# Altium project SAT_GPS_CLOCK_1.PrjPcb
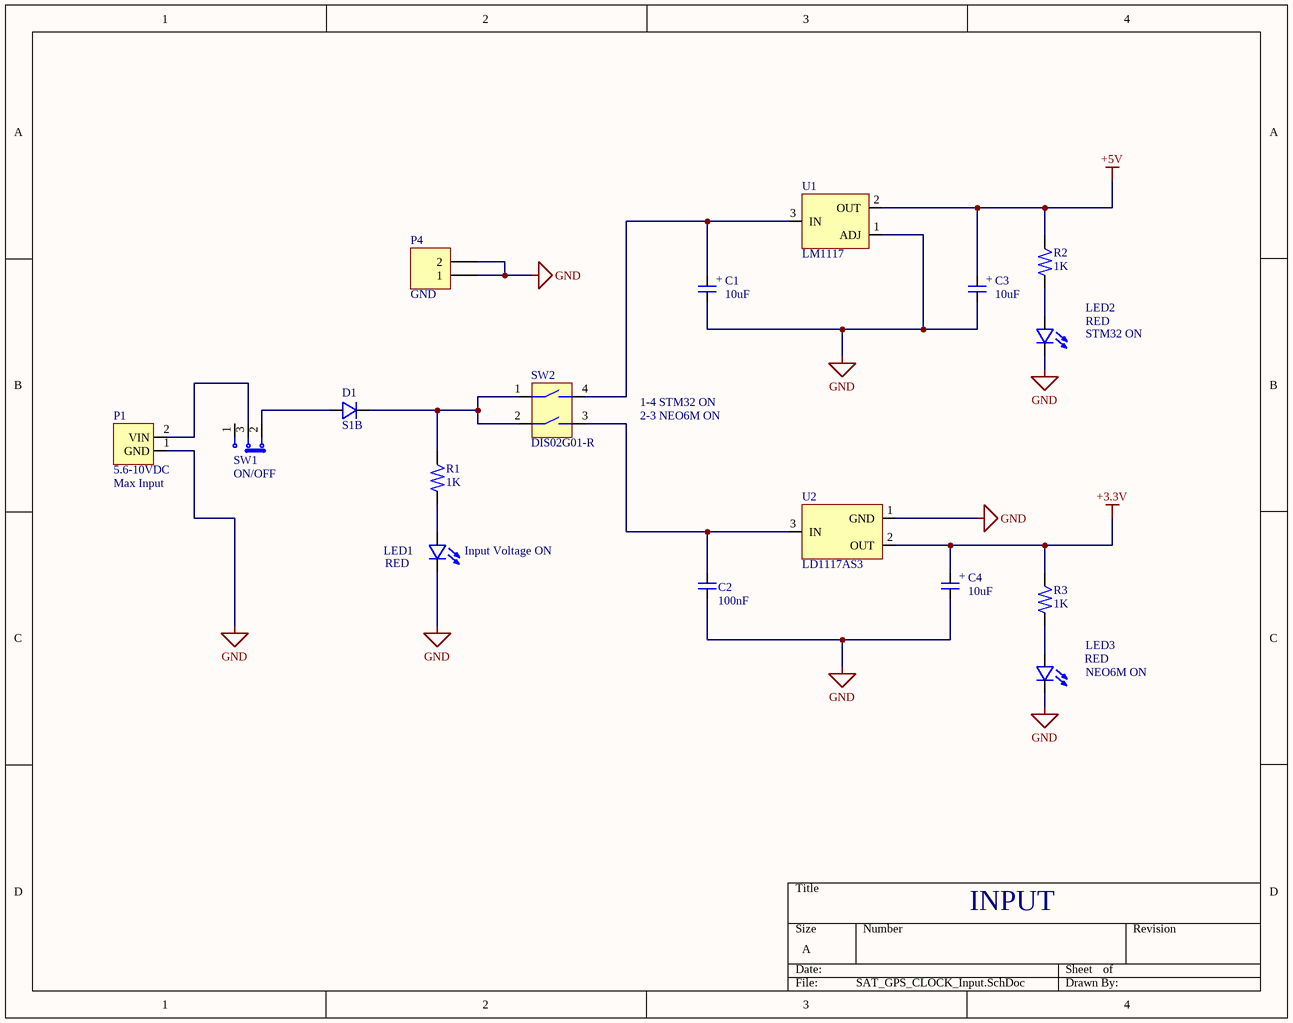
[diagram p0: SAT_GPS_CLOCK_Input.SchDoc]
2 sheets, 20 parts. Net scope: global (net labels, ports and power ports of the same name join across sheets).
Board file: SAT_GPS_CLOCK_1.PcbDoc
Sheets:
  SAT_GPS_CLOCK_Input.SchDoc
  SAT_GPS_CLOCK_IC.SchDoc

## Sheet SAT_GPS_CLOCK_Input.SchDoc
size A; SheetNumber: 1; SheetTotal: 2

### Parts
C1  10uF  [SMT_CAP_EL_CHANG_VT1E100MC054000CE0]
C2  100nF  [SMT_CAP_1206(3216)_SAMSUNG]
C3  10uF  [SMT_CAP_EL_CHANG_VT1E100MC054000CE0]
C4  10uF  [SMT_CAP_EL_CHANG_VT1E100MC054000CE0]
D1  S1B  [DIOM4227X23N]
LED1  RED  [DIOM2012X18N]
LED2  RED  [DIOM2012X18N]
LED3  RED  [DIOM2012X18N]
P1  5.6-10VDC  [THT_CON_WAFER_2P_RIGHT-ANGLE_A2010WR0-2P-SW-5E]
P4  GND  [HDR1X2]
R1  1K  [SMT_RES_0805(2012)]
R2  1K  [SMT_RES_0805(2012)]
R3  1K  [SMT_RES_0805(2012)]
SW1  ON/OFF  [THT_SSW_ESP1010]
SW2  DIS02G01-R  [SMT_SWITCH_DIP_DIS02G01-R]
U1  LM1117  [SOT230P700X180-4N]
U2  LD1117AS3  [SMT_VR_LD1117AS3]

### Nets
+3.3V: C4.1 R3.2 U2.2(OUT)
+5V: C3.1 R2.2 U1.2(OUT)
GND: C1.2 C2.1 C3.2 C4.2 LED1.2 LED2.2 LED3.2 P1.1(GND) P4.1 P4.2 U1.1(ADJ) U2.1(GND)
NetC1_1: C1.1 SW2.4 U1.3(IN)
NetC2_2: C2.2 SW2.3 U2.3(IN)
NetD1_1: D1.1 SW1.2
NetD1_2: D1.2 R1.2 SW2.1 SW2.2
NetLED1_1: LED1.1 R1.1
NetLED2_1: LED2.1 R2.1
NetLED3_1: LED3.1 R3.1
NetP1_2: P1.2(VIN) SW1.3

Not connected (* = marked no-connect by the designer): SW1 1

### Notes on the sheet
- (near LED2) STM32 ON
- 2-3 NEO6M ON
- 1-4 STM32 ON
- (near P1) Max Input
- (near LED1) Input Voltage ON
- (near LED3) NEO6M ON
- INPUT
- (in symbol SMT_CAP_EL_CHANG_VT1E100MC054000CE0) +

### Library data of the parts
C1 C3 C4 = SMT_CAP_EL_CHANG_VT1E100MC054000CE0: SMT Capacitor Electrolytic 35V 10uF Pitch 1.3mm VT1E100MC054000CE0
C2 = SMT_CAP_1206(3216)_SAMSUNG: Ceramic Capacitor 1206(3216) Samsung CL31B104KBCNNNC 50VDC
D1 = SMT_DIODE_DO-214AC: Standart Diode DO-214AC 1A
LED1-LED3 = SMT_LED_0805(2012): Led Diode 0805(2012) Cathode Mark, 20mA
P1 = THT_CON_WAFER_2P_RIGHT-ANGLE_A2010WR0-2P-SW-5E: Connector Wafer 2-Pins Pitch-2.0mm Right Angle A2010WR0-2P-SW-5E
P4 = Header 2: Header, 2-Pin; LatestRevisionDate: 17-Jul-2002; LatestRevisionNote: Re-released for DXP Platform.; Publisher: Altium Limited
R1-R3 = SMT_RES_0805(2012): 0805(2012) Resistor 1/4-1/8W 150V 2A
SW1 = THT_SSW_ESP1010: Slide Switch ESP1010 12V 0.5A
SW2 = SMT_SWITCH_DIP_DIS02G01-R: DIP SMD Switch 2-Line 4-Pole 2.54Pitch Rating 25mA/24Vdc Height 0.70mm
U1 = LM1117_SOT-223: LM1117 SOT-223 5V HTC Voltage Regulator
U2 = SMT_VR_LD1117AS3: Voltage Regulator ST LD1117AS33TR 1A 3.3V 10Vmax

## Sheet SAT_GPS_CLOCK_IC.SchDoc
size A; SheetNumber: 2; SheetTotal: 2
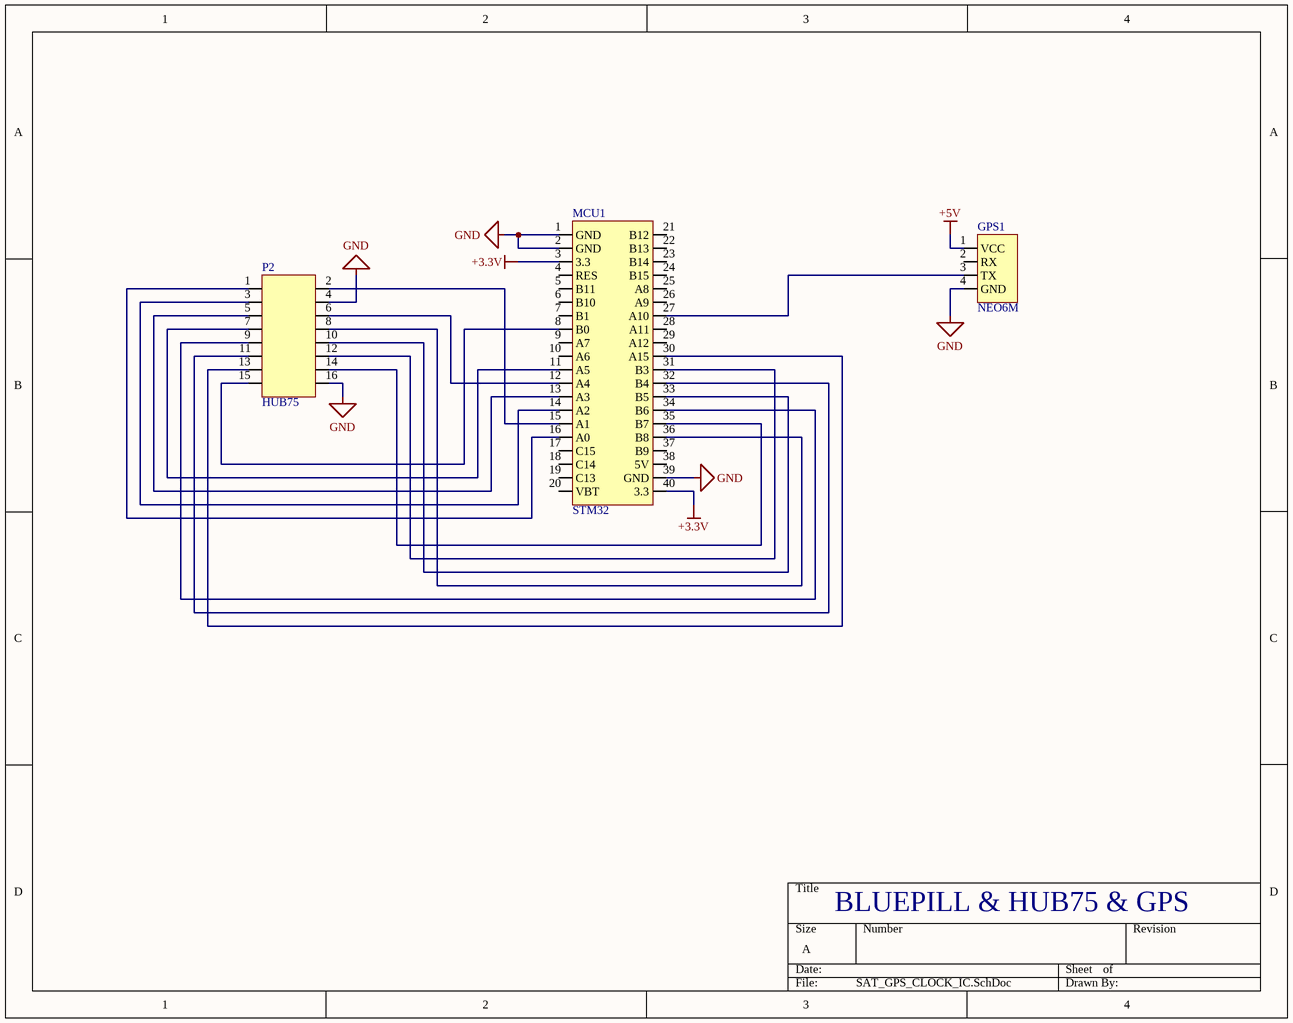
[diagram p1: SAT_GPS_CLOCK_IC.SchDoc]

### Parts
GPS1  NEO6M  [THT_NEO6M_FINAL]
MCU1  STM32  [STM32F103C6T6_THT]
P2  HUB75  [THT_CON_2316S-16G]

### Nets
+3.3V: MCU1.3(3.3) MCU1.40(3.3)
+5V: GPS1.1(VCC)
GND: GPS1.4(GND) MCU1.1(GND) MCU1.2(GND) MCU1.39(GND) P2.4 P2.16
NetGPS1_3: GPS1.3(TX) MCU1.27(A10)
NetMCU1_8: MCU1.8(B0) P2.15
NetMCU1_11: MCU1.11(A5) P2.7
NetMCU1_12: MCU1.12(A4) P2.6
NetMCU1_13: MCU1.13(A3) P2.5
NetMCU1_14: MCU1.14(A2) P2.3
NetMCU1_15: MCU1.15(A1) P2.2
NetMCU1_16: MCU1.16(A0) P2.1
NetMCU1_30: MCU1.30(A15) P2.13
NetMCU1_31: MCU1.31(B3) P2.12
NetMCU1_32: MCU1.32(B4) P2.11
NetMCU1_33: MCU1.33(B5) P2.10
NetMCU1_34: MCU1.34(B6) P2.9
NetMCU1_35: MCU1.35(B7) P2.14
NetMCU1_36: MCU1.36(B8) P2.8

Not connected (* = marked no-connect by the designer): GPS1 2(RX); MCU1 4(RES) 5(B11) 6(B10) 7(B1) 9(A7) 10(A6) 17(C15) 18(C14) 19(C13) 20(VBT) 21(B12) 22(B13) 23(B14) 24(B15) 25(A8) 26(A9) 28(A11) 29(A12) 37(B9) 38(5V)

### Notes on the sheet
- BLUEPILL & HUB75 & GPS

### Library data of the parts
GPS1 = THT_NEO6M_FINAL: GPS Module NEO6M Breakout Board
MCU1 = STM32F103C6T6_THT: STM32F103C8T6 Blue Pill
P2 = THT_CON_2316S-16G: Connector 2316S-16G 16 Pin 2.54 Pitch

## Nets that join several sheets
+3.3V: SAT_GPS_CLOCK_Input (C4.1 R3.2 U2.2), SAT_GPS_CLOCK_IC (MCU1.3 MCU1.40)
+5V: SAT_GPS_CLOCK_Input (C3.1 R2.2 U1.2), SAT_GPS_CLOCK_IC (GPS1.1)
GND: SAT_GPS_CLOCK_Input (12 pins), SAT_GPS_CLOCK_IC (6 pins)